# Altium project SNES TST Adapter.PrjPcb
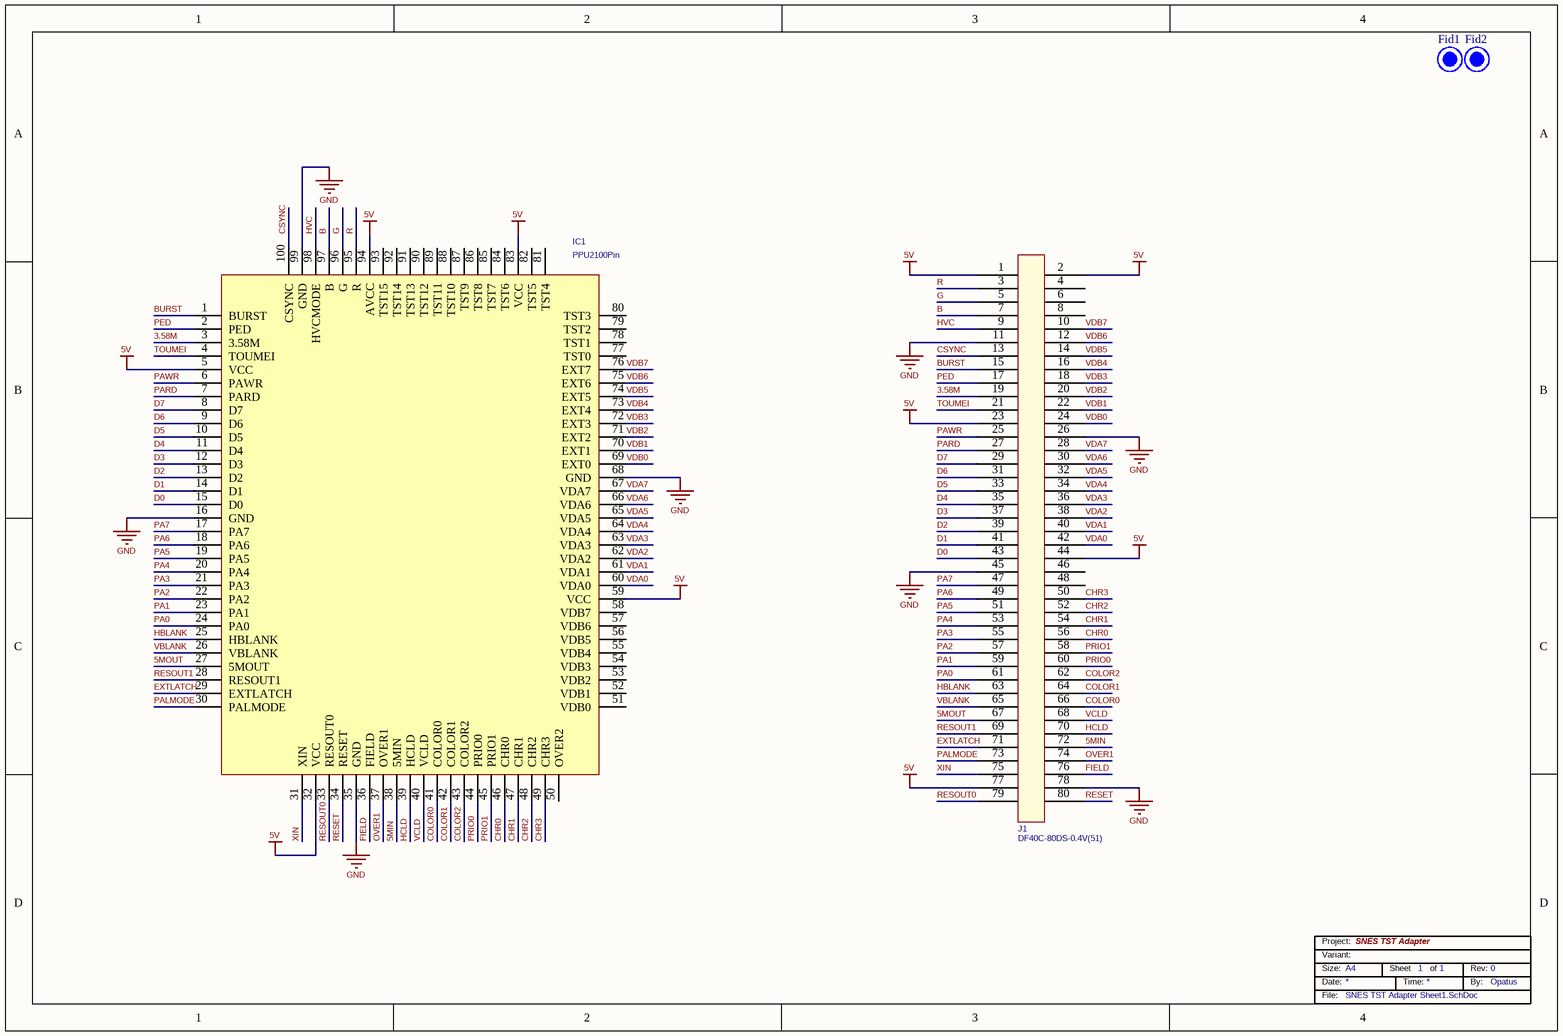
[diagram p0: SNES TST Adapter Sheet1.SchDoc]
Revision: Rev 0
1 sheet, 4 parts. Net scope: global (net labels, ports and power ports of the same name join across sheets).
Board files: SNES TST Adapter Type A.PcbDoc, SNES TST Adapter Type B.PcbDoc

## Sheet SNES TST Adapter Sheet1.SchDoc: SNES TST Adapter
size A4; DrawnBy: Opatus; DocumentNumber: 1; Revision: 0; SheetNumber: 1; SheetTotal: 1

### Parts
Fid1  Fiducial  [Fiducial_1_side]  (value not drawn)  (no BOM)
Fid2  Fiducial  [Fiducial_1_side]  (value not drawn)  (no BOM)
IC1  PPU2100Pin  [PPU100Pin_Double]  (no BOM)
J1  DF40C-80DS-0.4V(51)  [DF40C-80DS]

### Nets
5V: IC1.5(VCC) IC1.32(VCC) IC1.59(VCC) IC1.83(VCC) IC1.94(AVCC) J1.1 J1.2 J1.23 J1.44 J1.77
GND: IC1.16(GND) IC1.35(GND) IC1.68(GND) IC1.99(GND) J1.11 J1.26 J1.45 J1.78
3.58M: IC1.3(3.58M) J1.19
5MIN: IC1.38(5MIN) J1.72
5MOUT: IC1.27(5MOUT) J1.67
B: IC1.97(B) J1.7
BURST: IC1.1(BURST) J1.15
CHR0: IC1.46(CHR0) J1.56
CHR1: IC1.47(CHR1) J1.54
CHR2: IC1.48(CHR2) J1.52
CHR3: IC1.49(CHR3) J1.50
COLOR0: IC1.41(COLOR0) J1.66
COLOR1: IC1.42(COLOR1) J1.64
COLOR2: IC1.43(COLOR2) J1.62
CSYNC: IC1.100(CSYNC) J1.13
D0: IC1.15(D0) J1.43
D1: IC1.14(D1) J1.41
D2: IC1.13(D2) J1.39
D3: IC1.12(D3) J1.37
D4: IC1.11(D4) J1.35
D5: IC1.10(D5) J1.33
D6: IC1.9(D6) J1.31
D7: IC1.8(D7) J1.29
EXTLATCH: IC1.29(EXTLATCH) J1.71
FIELD: IC1.36(FIELD) J1.76
G: IC1.96(G) J1.5
HBLANK: IC1.25(HBLANK) J1.63
HCLD: IC1.39(HCLD) J1.70
HVC: IC1.98(HVCMODE) J1.9
OVER1: IC1.37(OVER1) J1.74
PA0: IC1.24(PA0) J1.61
PA1: IC1.23(PA1) J1.59
PA2: IC1.22(PA2) J1.57
PA3: IC1.21(PA3) J1.55
PA4: IC1.20(PA4) J1.53
PA5: IC1.19(PA5) J1.51
PA6: IC1.18(PA6) J1.49
PA7: IC1.17(PA7) J1.47
PALMODE: IC1.30(PALMODE) J1.73
PARD: IC1.7(PARD) J1.27
PAWR: IC1.6(PAWR) J1.25
PED: IC1.2(PED) J1.17
PRIO0: IC1.44(PRIO0) J1.60
PRIO1: IC1.45(PRIO1) J1.58
R: IC1.95(R) J1.3
RESET: IC1.34(RESET) J1.80
RESOUT0: IC1.33(RESOUT0) J1.79
RESOUT1: IC1.28(RESOUT1) J1.69
TOUMEI: IC1.4(TOUMEI) J1.21
VBLANK: IC1.26(VBLANK) J1.65
VCLD: IC1.40(VCLD) J1.68
VDA0: IC1.60(VDA0) J1.42
VDA1: IC1.61(VDA1) J1.40
VDA2: IC1.62(VDA2) J1.38
VDA3: IC1.63(VDA3) J1.36
VDA4: IC1.64(VDA4) J1.34
VDA5: IC1.65(VDA5) J1.32
VDA6: IC1.66(VDA6) J1.30
VDA7: IC1.67(VDA7) J1.28
VDB0: IC1.69(EXT0) J1.24
VDB1: IC1.70(EXT1) J1.22
VDB2: IC1.71(EXT2) J1.20
VDB3: IC1.72(EXT3) J1.18
VDB4: IC1.73(EXT4) J1.16
VDB5: IC1.74(EXT5) J1.14
VDB6: IC1.75(EXT6) J1.12
VDB7: IC1.76(EXT7) J1.10
XIN: IC1.31(XIN) J1.75

Not connected (* = marked no-connect by the designer): IC1 50(OVER2) 51(VDB0) 52(VDB1) 53(VDB2) 54(VDB3) 55(VDB4) 56(VDB5) 57(VDB6) 58(VDB7) 77(TST0) 78(TST1) 79(TST2) 80(TST3) 81(TST4) 82(TST5) 84(TST6) 85(TST7) 86(TST8) 87(TST9) 88(TST10) 89(TST11) 90(TST12) 91(TST13) 92(TST14) 93(TST15); J1 4 6 8 46 48

### Notes on the sheet
- Size:
- Date:
- Variant:
- Project:
- A4
- Sheet
- Time:
- of
- Rev:
- By:
- File:

### Library data of the parts
IC1 = PPU2100Pin: PPU2
J1 = Conn 80P: 80Pole Connector; Vendor: Hirose Connector; System: Connector; Manufacturer_Part_Number: DF40C-80DS-0.4V(51)